# EAGLE schematic PTproj (EAGLE 9.0.1)
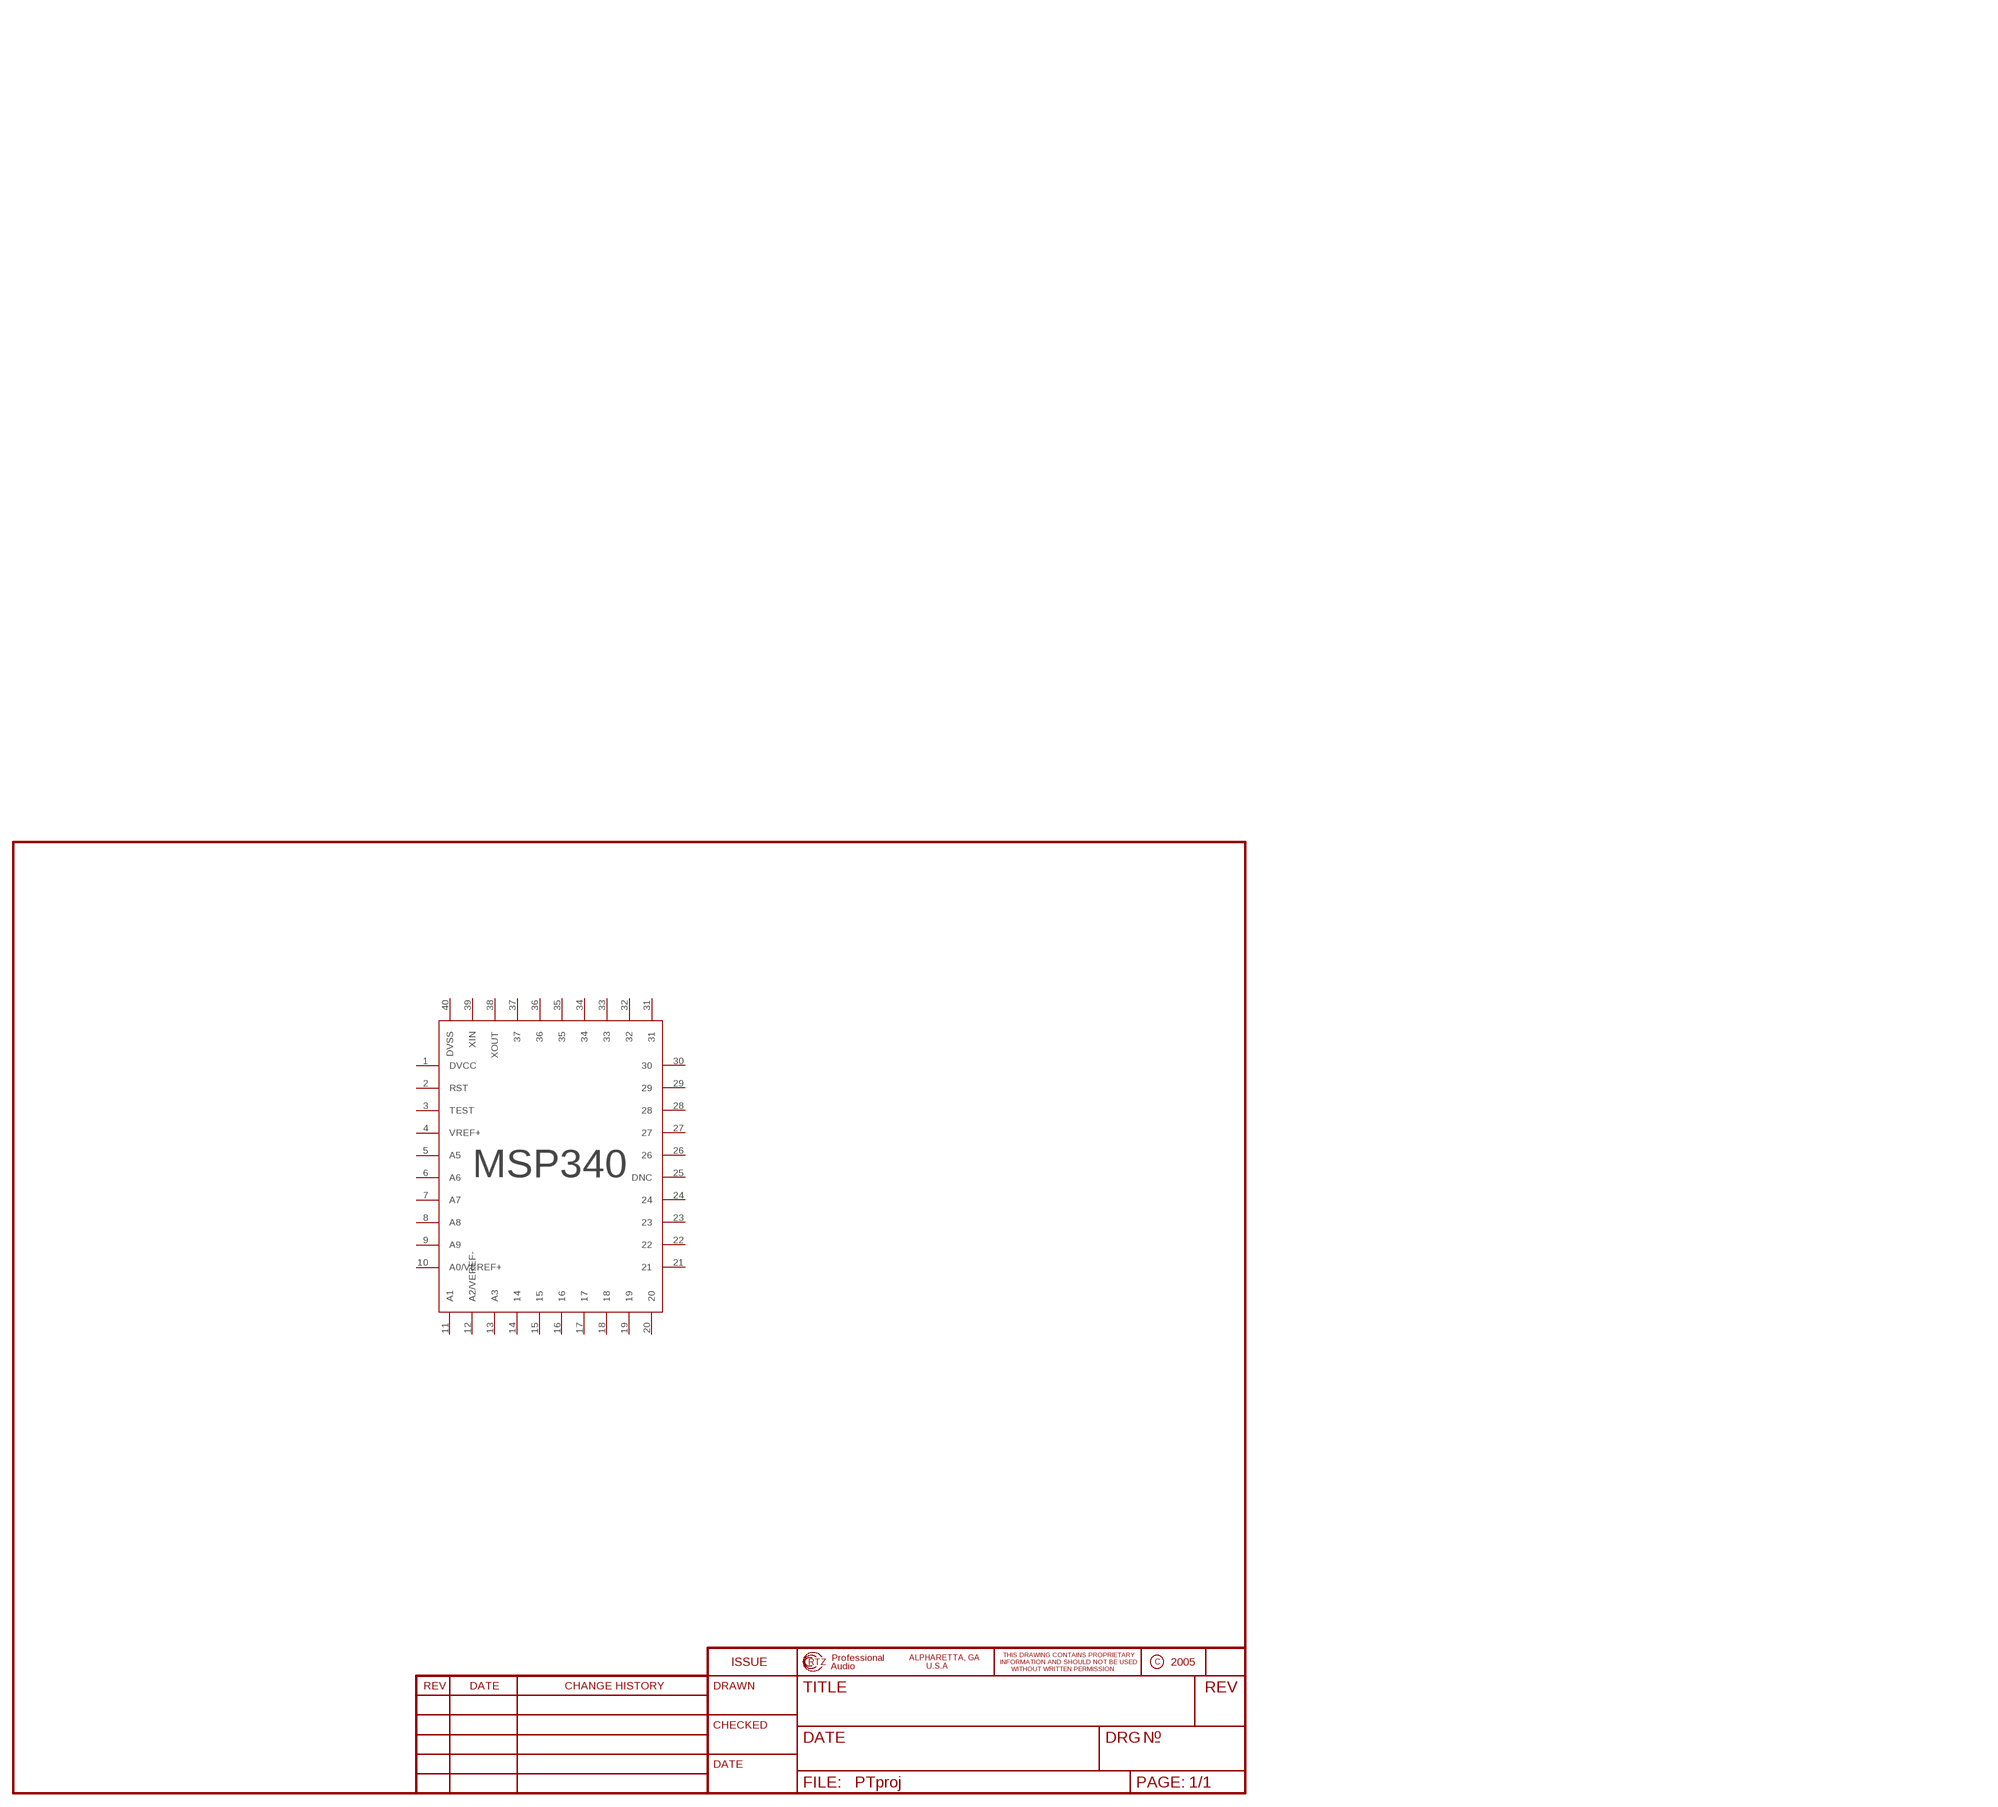
[diagram p0: schematic, sheet 1]

## Parts
U$1  MSP340FR247  [QFN-40]
Unconnected: U$1.1(DVCC) U$1.2(RST) U$1.3(TEST) U$1.4(VREF+) U$1.5(A5) U$1.6(A6) U$1.7(A7) U$1.8(A8) U$1.9(A9) U$1.10(A0/VEREF+) U$1.11(A1) U$1.12(A2/VEREF-) U$1.13(A3) U$1.14 U$1.15 U$1.16 U$1.17 U$1.18 U$1.19 U$1.20 U$1.21 U$1.22 U$1.23 U$1.24 U$1.25(DNC) U$1.26 U$1.27 U$1.28 U$1.29 U$1.30 U$1.31 U$1.32 U$1.33 U$1.34 U$1.35 U$1.36 U$1.37 U$1.38(XOUT) U$1.39(XIN) U$1.40(DVSS)

## Library data of the parts
U$1 = ti_msp430fr247:MSP340FR247